# Altium schematic sheet OpenMPPT2-DEBUG.SchDoc: =Project + Document
size A4; SheetNumber: 7; SheetTotal: SheetTotaal; Document: DEBUG
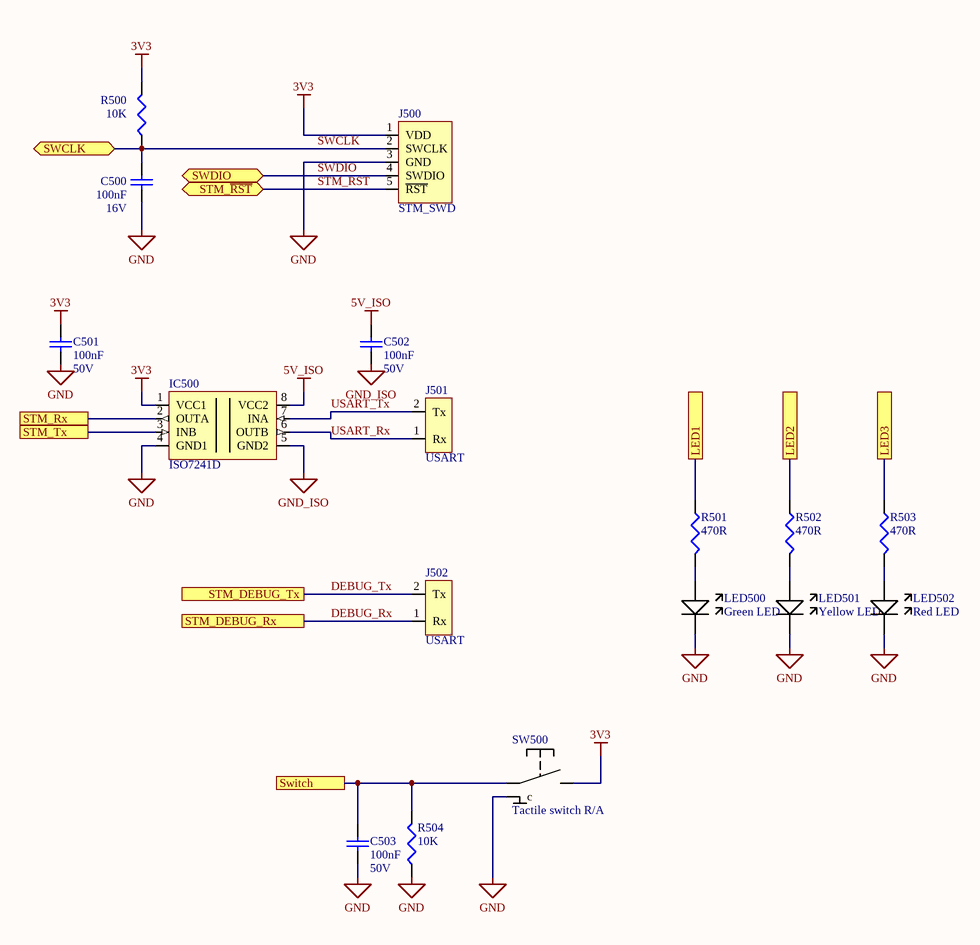
[diagram p0: OpenMPPT2-DEBUG.SchDoc]

## Parts
C500  100nF  Voltage Rating: 16V  [C0603]
C501  100nF  Voltage Rating: 50V  [C0603]
C502  100nF  Voltage Rating: 50V  [C0603]
C503  100nF  Voltage Rating: 50V  [C0603]
IC500  ISO7241D  [SO-8]
J500  STM_SWD  [Header 2.54 5p]
J501  USART  [HEADER 2.54mm 2pin]
J502  USART  [HEADER 2.54mm 2pin]
LED500  Green LED  [0603]
LED501  Yellow LED  [0603]
LED502  Red LED  [0603]
R500  10K  [0603]
R501  470R  [0603]
R502  470R  [0603]
R503  470R  [0603]
R504  10K  [0603]
SW500  Tactile switch R/A  [TactSW RA]

## Ports
LED1, LED2, LED3, STM_DEBUG_Rx, STM_DEBUG_Tx, STM_Rx, STM_Tx, STM_~{RST}, SWCLK, SWDIO, Switch

## Nets
3V3: C501.2 IC500.1(VCC1) J500.1(VDD) R500.2 SW500.2
5V_ISO: C502.2 IC500.8(VCC2)
GND: C500.2 C501.1 C503.1 IC500.4(GND1) J500.3(GND) LED500.K LED501.K LED502.K R504.1 SW500.0(c)
GND_ISO: C502.1 IC500.5(GND2)
DEBUG_Rx: J502.1(Rx) ; port STM_DEBUG_Rx
DEBUG_Tx: J502.2(Tx) ; port STM_DEBUG_Tx
LED1: R501.1 ; port LED1
LED2: R502.1 ; port LED2
LED3: R503.1 ; port LED3
STM_~{RST}: J500.5(~{RST}) ; port STM_~{RST}
STM_Rx: IC500.2(OUTA) ; port STM_Rx
STM_Tx: IC500.3(INB) ; port STM_Tx
SWCLK: C500.1 J500.2(SWCLK) R500.1 ; port SWCLK
SWDIO: J500.4(SWDIO) ; port SWDIO
Switch: C503.2 R504.2 SW500.1 ; port Switch
USART_Rx: IC500.6(OUTB) J501.1(Rx)
USART_Tx: IC500.7(INA) J501.2(Tx)
NetLED500_A: LED500.A R501.2
NetLED501_A: LED501.A R502.2
NetLED502_A: LED502.A R503.2

## Notes on the sheet
- Title
- Size:
- Date:
- A4
- Designer:
- Time:
- Revision:
- Sheet
- of
- File:

## Library data of the parts
C500 = 100nF/0603/CER/16V: Capacitor, 100nF, 16V, X7R; Capacitance Tolerance: ± 10%; Capacitor Case Style: 0603; Brand Number: MC0603B104K160CT; Brand: MULTICOMP; Dielectric Characteristic: X7R; Capacitance: 100nF; Temperature Range: -55°C to +125°C; Price: 0,01; Order Code Supplier: 1759016; Supplier: Farnell
C501-C503 = 100nF/0603/CER/50V: Capacitor, 100nF, 50V, X7R; Capacitance Tolerance: ± 10%; Capacitor Case Style: 0603; Brand Number: MCCA000255; Brand: MULTICOMP; Dielectric Characteristic: X7R; Capacitance: 100nF; Temperature Range: -55°C to +125°C; Price: 0,008; Order Code Supplier: 1759122RL; Supplier: Farnell
IC500 = ISO7241D: 1/1, 1Mbps Digital Isolator; Brand: Texas Instruments; Brand Number: ISO7241D; Case Style: SO-8; Order Code Supplier: 813-6582; Price: 2,392; Supplier: RS; Temperature Range: -40°C to +85°C
J500 = STM_SWD: SWD connector compliant with STM32 Nucleo boards
LED500 = KPT-1608SGC: LED, Green, 0603; Brand: Kingbright; Forward Voltage: 2.2V; Forward Current: 20mA; Order Code Supplier: 2099223; Supplier: Farnell; Price: 0,057; Brand Number: KPT-1608SGC
LED501 = KPT-2012YC: LED, Yellow, 0603; Brand: Kingbright; Forward Voltage: 2.1V; Forward Current: 20mA; Order Code Supplier: 2099243; Supplier: Farnell; Price: 0,045; Brand Number: KPT-2012YC
LED502 = KPT-2012EC: LED, Red, 0603; Brand: Kingbright; Forward Voltage: 2V; Forward Current: 20mA; Order Code Supplier: 2099236; Supplier: Farnell; Price: 0,052; Brand Number: KPT-2012EC
R500 R504 = 10K/0603/0063W/50V: Resistor, 10K, 1%, 0.063W, 50V, 100PPM, 0603; Brand: MULTICOMP; Brand Number: MC0063W0603110K; Case Style: 0603; Power Rating: 0.063W; Price: 0,038; Resistance: 10K; Supplier: Farnell; Temperature Coefficient: ± 100PPM; Temperature Range: -55°C to +125°C; Voltage Rating: 50V
  R500: Order Code Supplier: 2130939
  R504: Order Code Supplier: 1469748
R501-R503 = 470/0603/0125W/50V: Resistor, 470R, 1%, 0.125W, 50V, 100PPM, 0603; Brand: MULTICOMP; Brand Number: MCHP03W8F4700T5E; Case Style: 0603; Order Code Supplier: 1576273; Power Rating: 0.125W; Price: 0,08; Resistance: 470R; Supplier: Farnell; Temperature Coefficient: ± 100PPM; Temperature Range: -55°C to +155°C; Voltage Rating: 50V
SW500 = TactSwitch: Tactile switch angled; Brand Number: FSMRA4JH; Supplier: Farnell; Case Style: Switch; Price: 0.215; Order Code Supplier: 1555988; Supplier 1: Farnell; Supplier Part Number 1: 1555988